# Altium schematic sheet connector.SchDoc: Triumvi - Connectors
size Letter; Author: Ye-Sheng Kuo; Revision: 12; SheetNumber: 8; SheetTotal: 9
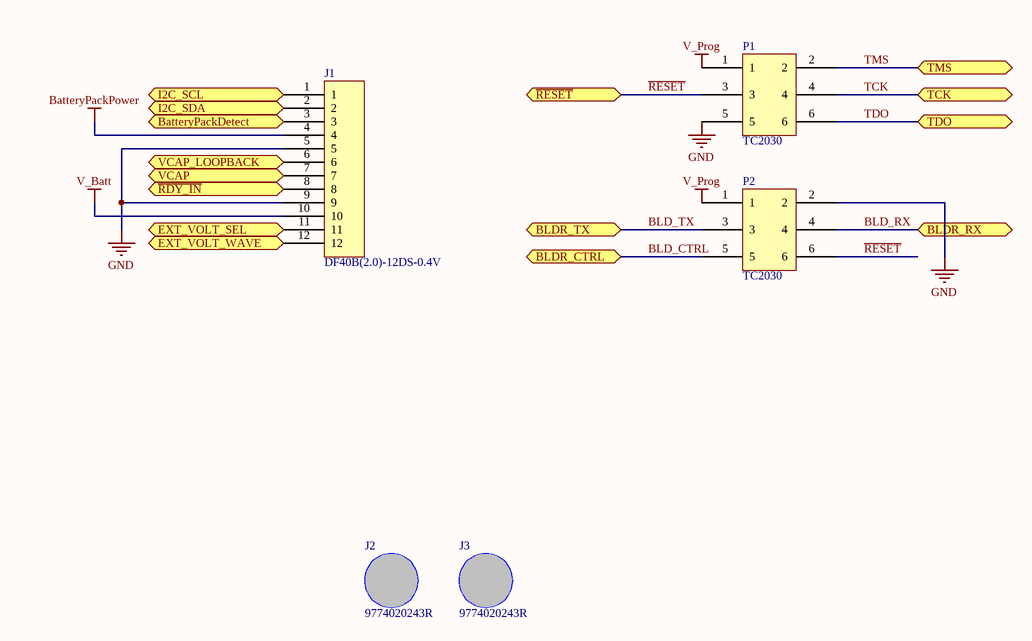
[diagram p0: connector.SchDoc]

## Parts
J1  DF40B(2.0)-12DS-0.4V  [DF40B(2.0)-12DS-0.4V]
J2  9774020243R  [9774020243R]
J3  9774020243R  [9774020243R]
P1  TC2030  [TC2030-IDC-NLFP]
P2  TC2030  [TC2030-IDC-NLFP]

## Ports
BatteryPackDetect, BLDR_CTRL, BLDR_RX, BLDR_TX, EXT_VOLT_SEL, EXT_VOLT_WAVE, I2C_SCL, I2C_SDA, TCK, TDO, TMS, VCAP, VCAP_LOOPBACK, ~{RDY_IN}, ~{RESET}

## Nets
BatteryPackPower: J1.4
GND: J1.5 J1.9 P1.5 P2.2
V_Batt: J1.10
V_Prog: P1.1 P2.1
BatteryPackDetect: J1.3 ; port BatteryPackDetect
BLD_CTRL: P2.5 ; port BLDR_CTRL
BLD_RX: P2.4 ; port BLDR_RX
BLD_TX: P2.3 ; port BLDR_TX
EXT_VOLT_SEL: J1.11 ; port EXT_VOLT_SEL
EXT_VOLT_WAVE: J1.12 ; port EXT_VOLT_WAVE
I2C_SCL: J1.1 ; port I2C_SCL
I2C_SDA: J1.2 ; port I2C_SDA
~{RDY_IN}: J1.8 ; port ~{RDY_IN}
~{RESET}: P1.3 P2.6 ; port ~{RESET}
TCK: P1.4 ; port TCK
TDO: P1.6 ; port TDO
TMS: P1.2 ; port TMS
VCAP: J1.7 ; port VCAP
VCAP_LOOPBACK: J1.6 ; port VCAP_LOOPBACK

## Notes on the sheet
- Title
- Date:
- Author:
- Revision:
- Sheet
- of
- University of Michigan
- File:

## Library data of the parts
J1 = DF40B(2.0)-12DS-0.4V: Hirose BM20 Series, 0.4mm pitch, 2mm stack height, 12 pos, header; Supplier 1: Digi-Key; Supplier Part Number 1: H124594CT-ND
J2 J3 = 9774020243R: 2 mm stack height, m2 standoff; Supplier 1: Digi-Key; Supplier Part Number 1: 732-7073-1-ND
P1 P2 = TC2030: TC2030-MCP-NL; Note: Not a part